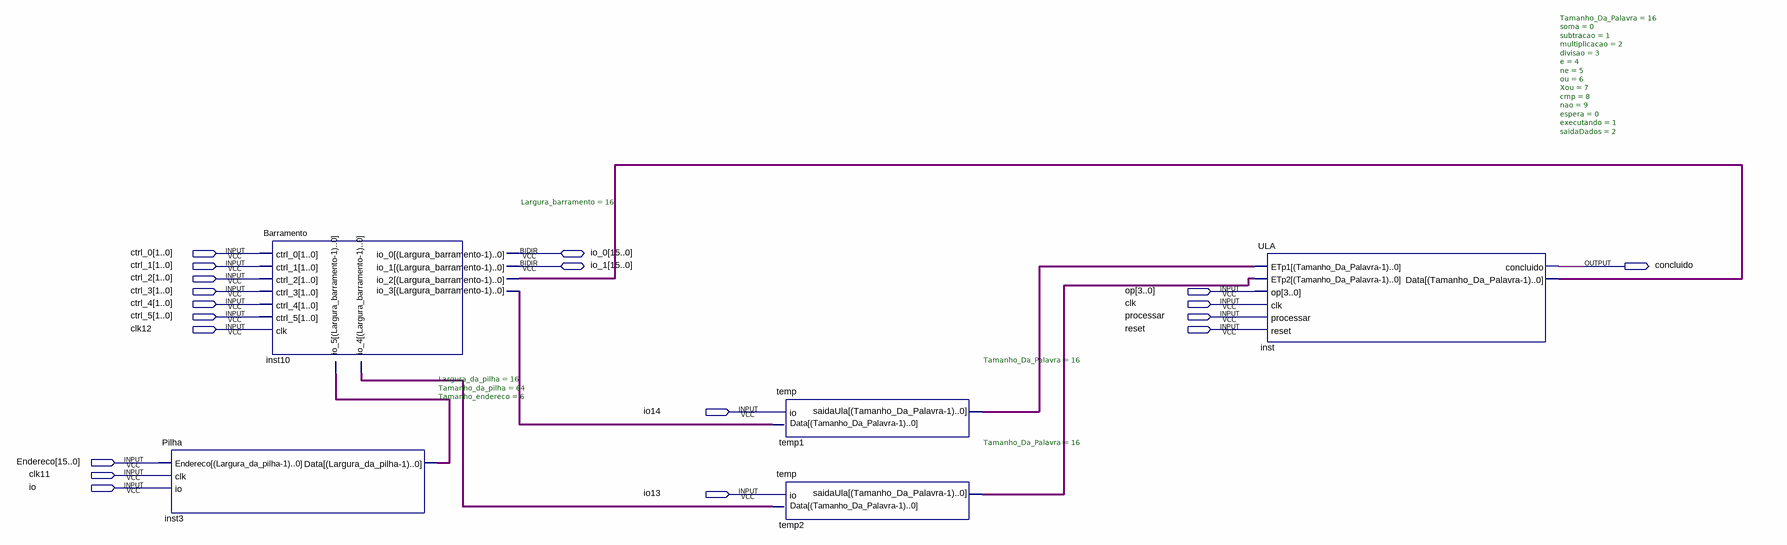
[diagram p0: schematic sheet]
// Quartus schematic Block1.bdf as structural Verilog: 5 symbols, 19 pins
module Block1 (
  input  [1:0] ctrl_0,
  input  [1:0] ctrl_1,
  input  [1:0] ctrl_2,
  input  [1:0] ctrl_3,
  input  [3:0] op,
  input  [1:0] ctrl_4,
  input  clk,
  input  [1:0] ctrl_5,
  input  processar,
  input  clk12,
  input  reset,
  input  io14,
  input  [15:0] Endereco,
  input  clk11,
  input  io,
  input  io13,
  inout  [15:0] io_0,
  inout  [15:0] io_1,
  output concluido
);

  wire [15:0] inst3_data, inst10_io_2, inst10_io_3, inst10_io_4, temp1_saidaula, temp2_saidaula;

  Pilha #(.Largura_da_pilha(16), .Tamanho_da_pilha(64), .Tamanho_endereco(6)) inst3 (
    .Endereco(Endereco), .clk(clk11), .io(io), .Data(inst3_data));
  Barramento #(.Largura_barramento(16)) inst10 (
    .ctrl_0(ctrl_0), .ctrl_1(ctrl_1), .ctrl_2(ctrl_2), .ctrl_3(ctrl_3), .ctrl_4(ctrl_4), .ctrl_5(ctrl_5),
    .clk(clk12), .io_0(io_0), .io_1(io_1), .io_2(inst10_io_2), .io_3(inst10_io_3), .io_5(inst3_data),
    .io_4(inst10_io_4));
  temp #(.Tamanho_Da_Palavra(16)) temp1 (.io(io14), .saidaUla(temp1_saidaula), .Data(inst10_io_3));
  temp #(.Tamanho_Da_Palavra(16)) temp2 (.io(io13), .saidaUla(temp2_saidaula), .Data(inst10_io_4));
  ULA #(.Tamanho_Da_Palavra(16), .soma(0), .subtracao(1), .multiplicacao(2), .divisao(3), .e(4), .ne(5), .ou(6), .Xou(7), .cmp(8), .nao(9), .espera(0), .executando(1), .saidaDados(2)) inst (
    .ETp1(temp1_saidaula), .ETp2(temp2_saidaula), .op(op), .clk(clk), .processar(processar), .reset(reset),
    .concluido(concluido), .Data(inst10_io_2));
endmodule
